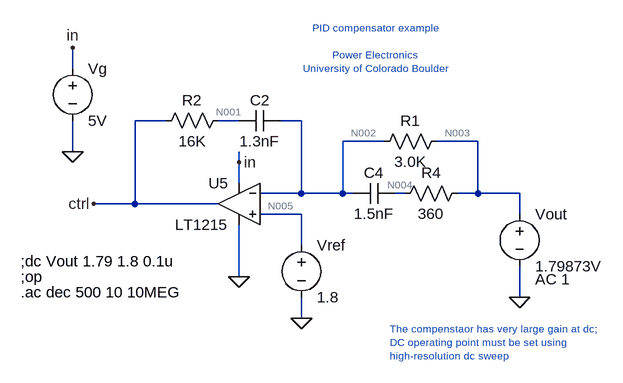
[diagram p0: schematic PID_compensator.asc]
PID_compensator.asc, the LTspice schematic file:
Version 4
SHEET 1 1364 756
WIRE -288 -176 -288 -208
WIRE -144 -96 -192 -96
WIRE -32 -96 -64 -96
WIRE 64 -96 32 -96
WIRE 192 -64 128 -64
WIRE 336 -64 272 -64
WIRE -288 -48 -288 -96
WIRE -32 -32 -32 -48
WIRE -32 0 -32 -32
WIRE 64 16 64 -96
WIRE 64 16 0 16
WIRE 128 16 128 -64
WIRE 128 16 64 16
WIRE 144 16 128 16
WIRE 224 16 208 16
WIRE 336 16 336 -64
WIRE 336 16 304 16
WIRE 400 16 336 16
WIRE -192 32 -192 -96
WIRE -192 32 -256 32
WIRE -64 32 -192 32
WIRE 64 48 0 48
WIRE 400 48 400 16
WIRE 64 96 64 48
WIRE -32 144 -32 64
WIRE 400 176 400 128
WIRE 64 208 64 176
FLAG -288 -48 0
FLAG -32 144 0
FLAG 64 208 0
FLAG -288 -208 in
FLAG -32 -32 in
FLAG 400 176 0
FLAG -256 32 ctrl
SYMBOL voltage -288 -192 R0
SYMATTR InstName Vg
SYMATTR Value 5V
SYMBOL Opamps\\LT1215 -32 -32 M0
SYMATTR InstName U5
SYMBOL cap 208 0 R90
WINDOW 0 0 32 VBottom 2
WINDOW 3 32 32 VTop 2
SYMATTR InstName C4
SYMATTR Value 1.5nF
SYMBOL cap 32 -112 R90
WINDOW 0 0 32 VBottom 2
WINDOW 3 32 32 VTop 2
SYMATTR InstName C2
SYMATTR Value 1.3nF
SYMBOL res -48 -112 R90
WINDOW 0 0 56 VBottom 2
WINDOW 3 32 56 VTop 2
SYMATTR InstName R2
SYMATTR Value 16K
SYMBOL res 320 0 R90
WINDOW 0 0 56 VBottom 2
WINDOW 3 32 56 VTop 2
SYMATTR InstName R4
SYMATTR Value 360
SYMBOL res 288 -80 R90
WINDOW 0 0 56 VBottom 2
WINDOW 3 32 56 VTop 2
SYMATTR InstName R1
SYMATTR Value 3.0K
SYMBOL voltage 64 80 R0
WINDOW 123 0 0 Left 2
WINDOW 39 0 0 Left 2
SYMATTR InstName Vref
SYMATTR Value 1.8
SYMBOL voltage 400 32 R0
WINDOW 123 24 116 Left 2
WINDOW 39 0 0 Left 2
SYMATTR Value2 AC 1
SYMATTR InstName Vout
SYMATTR Value 1.79873V
TEXT 176 -208 Center 1 ;PID compensator example\n \nPower Electronics\nUniversity of Colorado Boulder
TEXT -368 120 Left 2 !;dc Vout 1.79 1.8 0.1u
TEXT -368 144 Left 2 !;op
TEXT -368 168 Left 2 !.ac dec 500 10 10MEG
TEXT 200 224 Left 1 ;The compenstaor has very large gain at dc;\nDC operating point must be set using \nhigh-resolution dc sweep

The netlist it stands for:
* PID_compensator.asc
Vg in 0 5V
XU5 N005 N002 in 0 ctrl LT1215  ; pins In+ In- V+ V- OUT
C4 N004 N002 1.5nF
C2 N002 N001 1.3nF
R2 N001 ctrl 16K
R4 N003 N004 360
R1 N003 N002 3.0K
Vref N005 0 1.8
Vout N003 0 1.79873V AC 1
* PID compensator example
* Power Electronics
* University of Colorado Boulder
;dc Vout 1.79 1.8 0.1u
;op
.ac dec 500 10 10MEG
* The compenstaor has very large gain at dc;
* DC operating point must be set using
* high-resolution dc sweep
.lib LTC.lib
.backanno
.end

* Results of the author's LTspice run, read from the files saved beside the schematic
* Operating Point, zero values left out:
*   V(in) = 5 V
*   V(n002) = 1.8 V
*   V(n005) = 1.8 V
*   V(ctrl) = 1.902 V
*   V(n004) = 1.799 V
*   V(n001) = 1.902 V
*   V(n003) = 1.799 V
*   I(R1) = -423.5 nA
*   I(Vg) = -5.222 mA
*   I(Vref) = 423.5 nA
*   I(Vout) = 423.5 nA
*   Ix(u5:1) = -423.5 nA
*   Ix(u5:2) = -423.5 nA
*   Ix(u5:3) = 5.222 mA
*   Ix(u5:4) = -5.222 mA
*   Ix(u5:5) = 1.196 pA
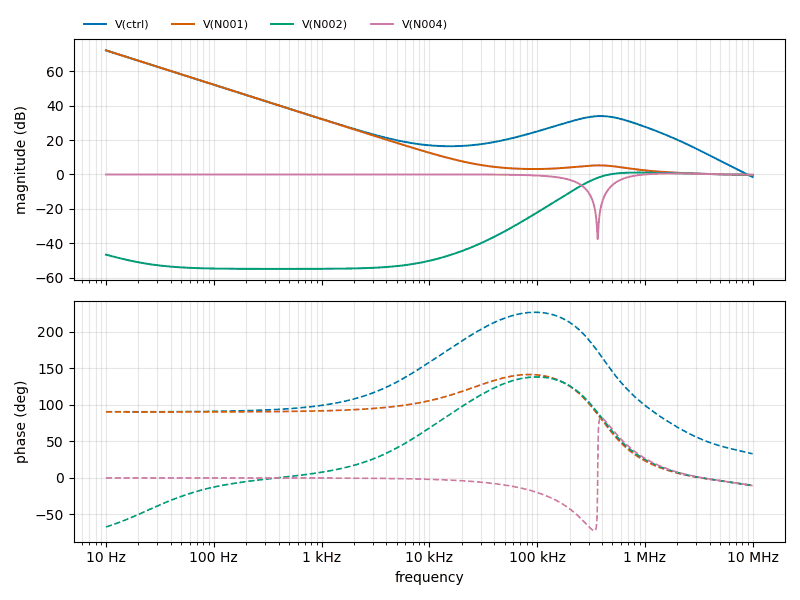
[diagram p1: AC Analysis of PID_compensator.asc, plotted from the saved traces]
* AC Analysis, 1 run:
*   V(ctrl): 72.20 dB at 10 Hz, -1.50 dB at 10 MHz, peak 72.20 dB at 10 Hz, 3 dB below the peak at 14.14 Hz
*   V(N001): 72.20 dB at 10 Hz, -0.25 dB at 10 MHz, peak 72.20 dB at 10 Hz, 3 dB below the peak at 14.14 Hz
*   V(N002): -46.68 dB at 10 Hz, -0.26 dB at 10 MHz, peak 1.11 dB at 871 kHz, 3 dB below the peak at 366.5 kHz
*   V(N004): 0.00 dB at 10 Hz, -0.21 dB at 10 MHz, peak 0.54 dB at 1.795 MHz, 3 dB below the peak at 631 kHz